# Altium schematic sheet project_pankov_1_power_supply.SchDoc: =title_line_1 + title_line_2
size 594 x 420 mm; SheetNumber: 1
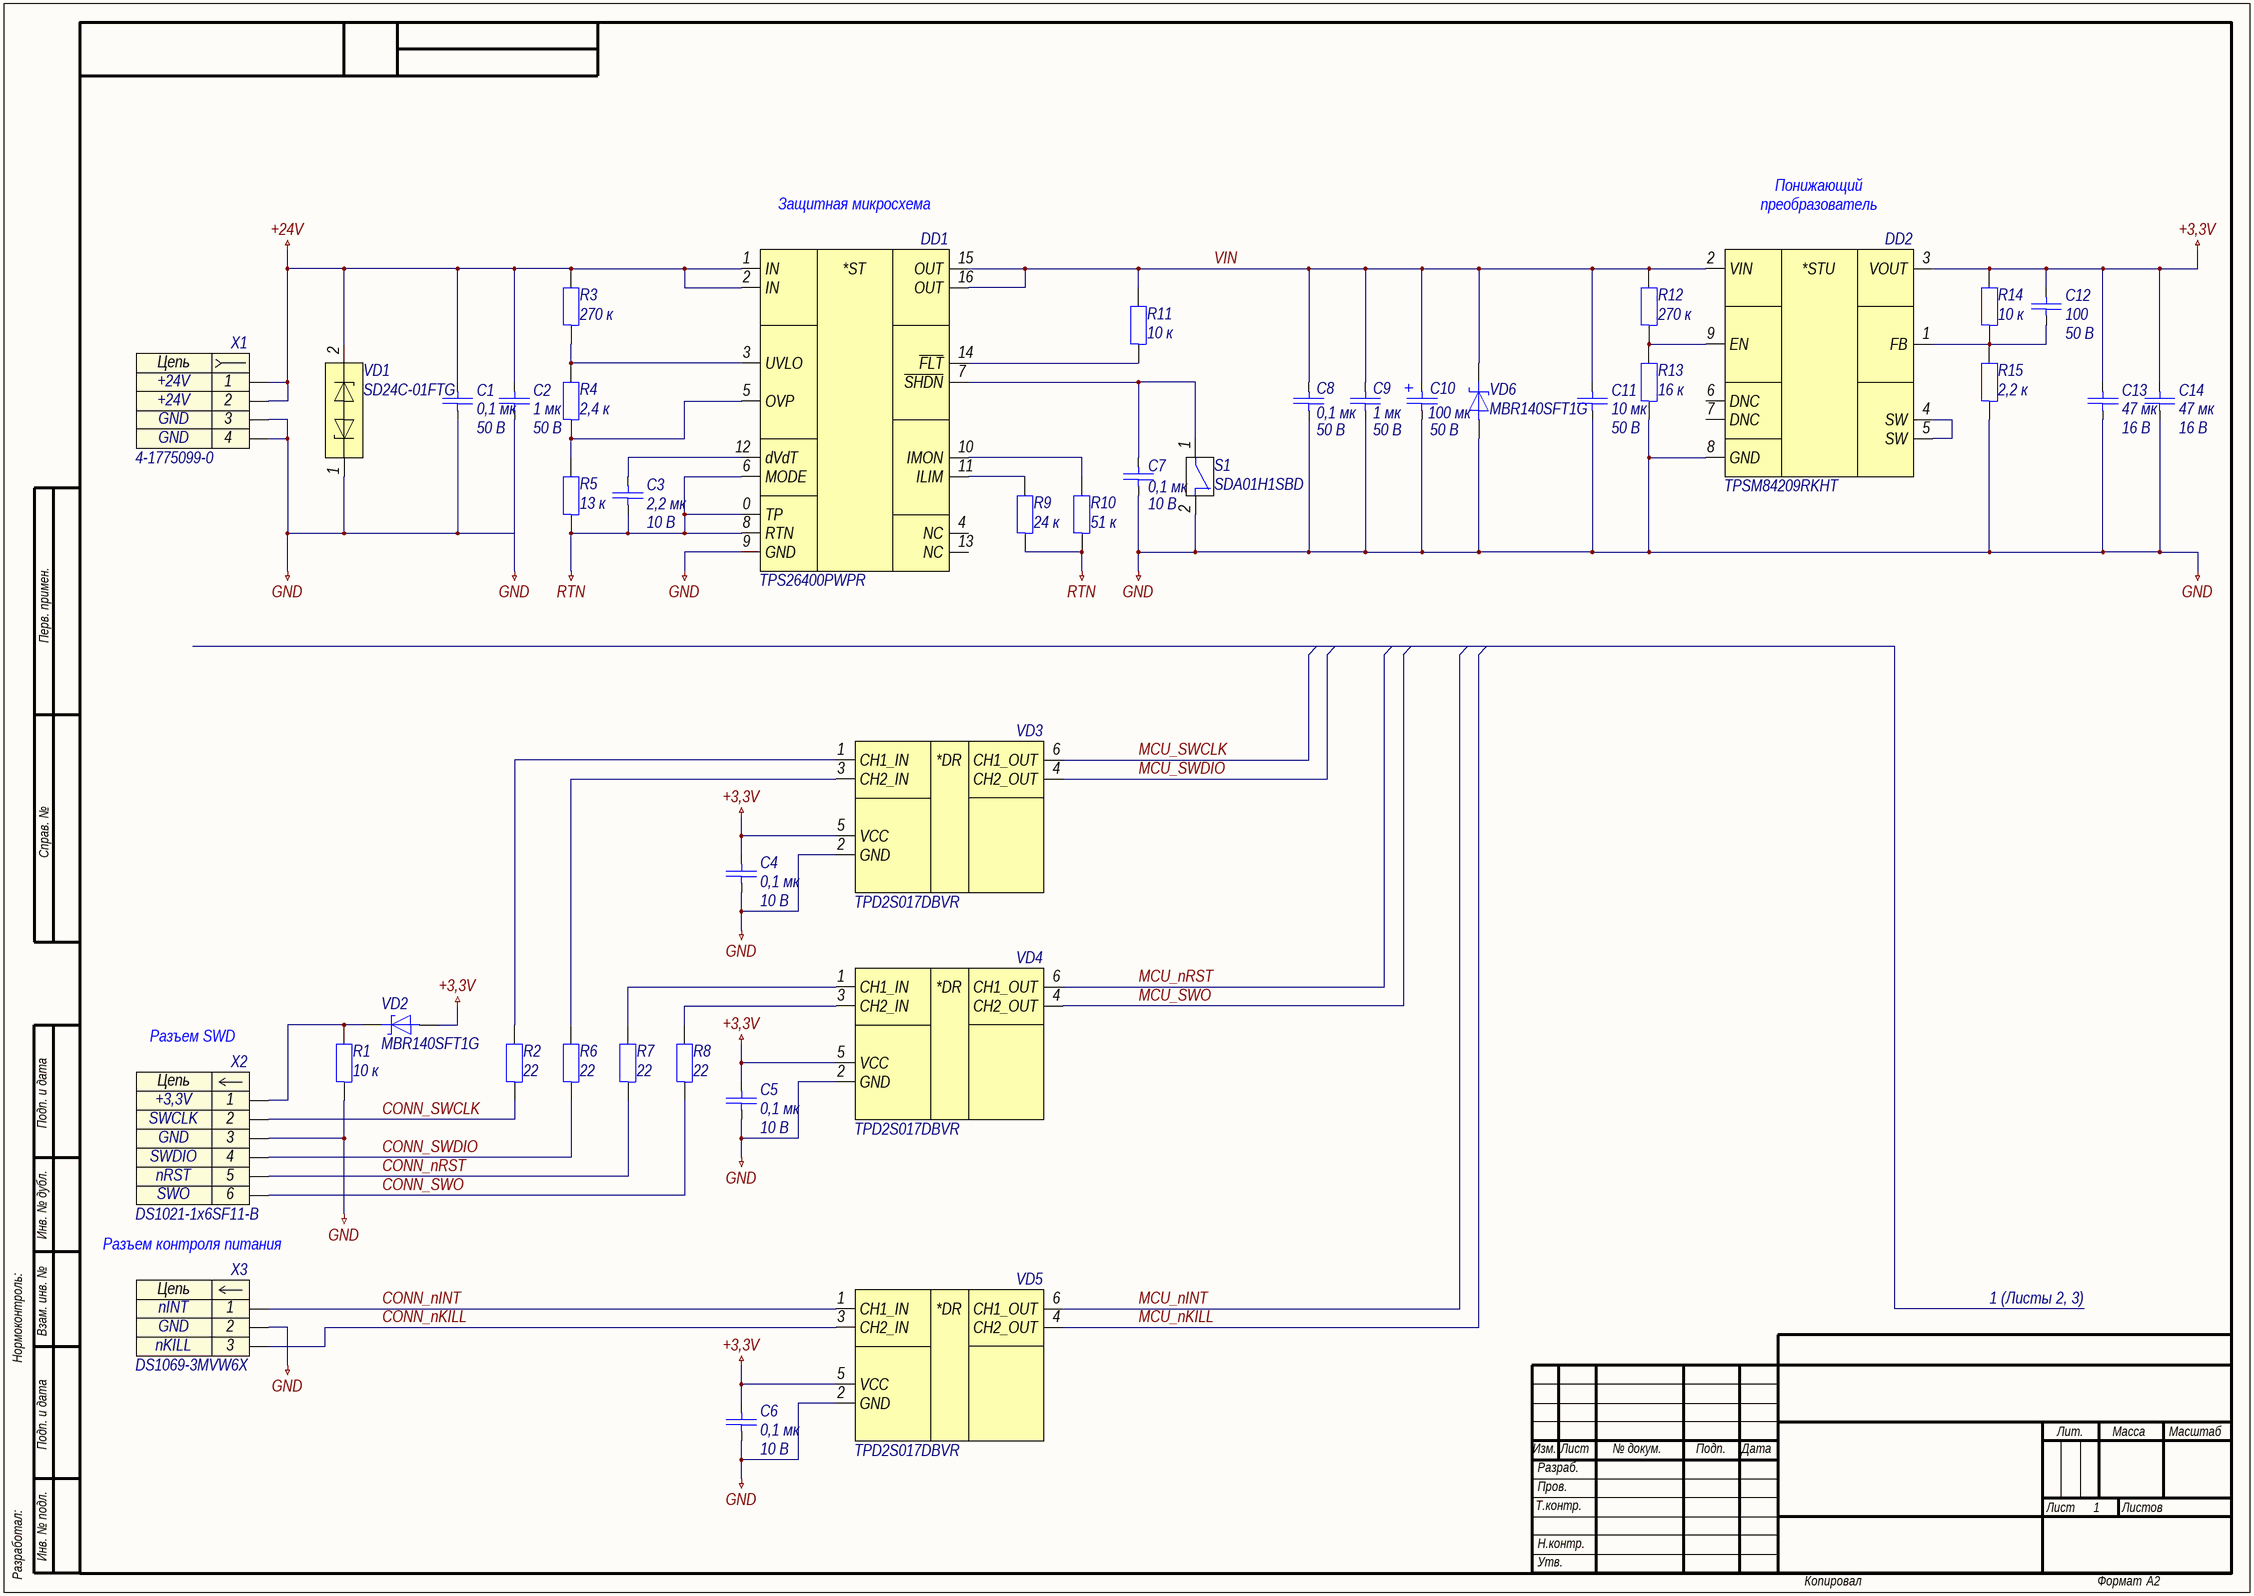
[diagram p0: project_pankov_1_power_supply.SchDoc]

## Parts
C1  0,1 мк  Напряжение: 50 В  [C0603]
C2  1 мк  Напряжение: 50 В  [C0603]
C3  2,2 мк  Напряжение: 10 В  [C0603]
C4  0,1 мк  Напряжение: 10 В  [C0603]
C5  0,1 мк  Напряжение: 10 В  [C0603]
C6  0,1 мк  Напряжение: 10 В  [C0603]
C7  0,1 мк  Напряжение: 10 В  [C0603]
C8  0,1 мк  Напряжение: 50 В  [C0603]
C9  1 мк  Напряжение: 50 В  [C0603]
C10  100 мк  Напряжение: 50 В  [CAPAE-660X660X800]
C11  10 мк  Напряжение: 50 В  [C1206]
C12  100  Напряжение: 50 В  [C0603]
C13  47 мк  Напряжение: 16 В  [C1206]
C14  47 мк  Напряжение: 16 В  [C1206]
DD1  TPS26400PWPR  [HTSSOP-16-P65-500X440X120-L63X25-T246X266]
DD2  TPSM84209RKHT  [QFN-FCMOD-9-P65-450X400X210]
R1  10 к  [R0603]
R2  22  [R0603]
R3  270 к  [R0603]
R4  2,4 к  [R0603]
R5  13 к  [R0603]
R6  22  [R0603]
R7  22  [R0603]
R8  22  [R0603]
R9  24 к  [R0603]
R10  51 к  [R0603]
R11  10 к  [R0603]
R12  270 к  [R0603]
R13  16 к  [R0603]
R14  10 к  [R0603]
R15  2,2 к  [R0603]
S1  SDA01H1SBD  [SDA01H1SBD]
VD1  SD24C-01FTG  [SOD-323-257X130X114]
VD2  MBR140SFT1G  [SOD-123FL-370X165X98]
VD3  TPD2S017DBVR  [SOT-23-6-P95-290X280X145]
VD4  TPD2S017DBVR  [SOT-23-6-P95-290X280X145]
VD5  TPD2S017DBVR  [SOT-23-6-P95-290X280X145]
VD6  MBR140SFT1G  [SOD-123FL-370X165X98]
X1  4-1775099-0  [4-1775099-0]
X2  DS1021-1x6SF11-B  [DS1021-1X6SF11-B]
X3  DS1069-3MVW6X  [DS1069-3MVW6X]

## Nets
+3,3V: C4.1 C5.1 C6.1 C12.1 C13.1 C14.1 DD2.3(VOUT) R14.2 VD2.2 VD3.5(VCC) VD4.5(VCC) VD5.5(VCC)
+24V: C1.1 C2.1 DD1.1(IN) DD1.2(IN) R3.2 VD1.2 X1.1 X1.2
GND: C1.2 C2.2 C4.2 C5.2 C6.2 C7.2 C8.2 C9.2 C10.2 C11.2 C13.2 C14.2 DD1.9(GND) DD2.8(GND) R1.1 R13.1 R15.1 S1.2 VD1.1 VD3.2(GND) VD4.2(GND) VD5.2(GND) VD6.2 X1.3 X1.4 X2.3 X3.2
RTN: C3.2 DD1.0(TP) DD1.6(MODE) DD1.8(RTN) R5.1 R9.1 R10.1
CONN_nINT: VD5.1(CH1_IN) X3.1
CONN_nKILL: VD5.3(CH2_IN) X3.3
CONN_nRST: R7.1 X2.5
CONN_SWCLK: R2.1 X2.2
CONN_SWDIO: R6.1 X2.4
CONN_SWO: R8.1 X2.6
MCU_nINT: VD5.6(CH1_OUT)
MCU_nKILL: VD5.4(CH2_OUT)
MCU_nRST: VD4.6(CH1_OUT)
MCU_SWCLK: VD3.6(CH1_OUT)
MCU_SWDIO: VD3.4(CH2_OUT)
MCU_SWO: VD4.4(CH2_OUT)
VIN: C8.1 C9.1 C10.1 C11.1 DD1.15(OUT) DD1.16(OUT) DD2.2(VIN) R11.2 R12.2 VD6.1
NetC3_1: C3.1 DD1.12(dVdT)
NetC7_1: C7.1 DD1.7(~{SHDN}) S1.1
NetC12_2: C12.2 DD2.1(FB) R14.1 R15.2
NetDD1_3: DD1.3(UVLO) R3.1 R4.2
NetDD1_5: DD1.5(OVP) R4.1 R5.2
NetDD1_10: DD1.10(IMON) R10.2
NetDD1_11: DD1.11(ILIM) R9.2
NetDD1_14: DD1.14(~{FLT}) R11.1
NetDD2_4: DD2.4(SW) DD2.5(SW)
NetDD2_9: DD2.9(EN) R12.1 R13.2
NetR1_2: R1.2 VD2.1 X2.1
NetR2_2: R2.2 VD3.1(CH1_IN)
NetR6_2: R6.2 VD3.3(CH2_IN)
NetR7_2: R7.2 VD4.1(CH1_IN)
NetR8_2: R8.2 VD4.3(CH2_IN)

Not connected (* = marked no-connect by the designer): DD1 4(NC) 13(NC); DD2 6(DNC) 7(DNC)

## Notes on the sheet
- Понижающий преобразователь напряжения 12 В/3,3 В
- (near DD1) Защитная микросхема
- Разъем SWD
- Разъем контроля питания
- 1 (Листы 2, 3)
- Перв. примен.
- Справ. №
- Подп. и дата
- Инв. № дубл.
- Нормоконтроль:
- Взам. инв. №
- Изм.
- Лист
- № докум.
- Подп.
- Дата
- Лит.
- Масса
- Масштаб
- Т.контр.
- Пров.
- Разраб.
- Листов
- Разработал:
- Инв. № подл.
- Н.контр.
- Утв.
- Копировал
- Формат
- А2
- (in symbol dd0005) *ST
- (in symbol dd0020) *STU
- (in symbol vd0016) *DR
- (in symbol x0006) Цепь
- (in symbol x0028) Цепь
- (in symbol x0043) Цепь

## Library data of the parts
C1 C8 = c0065: =Описание; ID: c0065; Фамилия: Паньков; Описание: Конденсатор керамический чип 0603 100 нФ 50 В ±10 %; Наименование: CC0603KRX7R9BB104; Производитель: YAGEO Corp.; Отклонение: ±10 %; Рабочие температуры: от –55 °С до +125 °С; Температурный коэффициент емкости: X7R; Корпус: 0603; Номинал: 0,1 мк; Номинальное напряжение: 50 В; HelpURL: https://www.yageo.com/upload/media/product/productsearch/datasheet/mlcc/UPY-GPHC_X7R_6.3V-to-50V_20.pdf
C2 C9 = c0095: =Описание; ID: c0095; Фамилия: Паньков; Описание: Конденсатор керамический чип 0603 1 мкФ 50 В ±10 %; Наименование: CC0603KRX7R9BB105; Производитель: YAGEO Corp.; Отклонение: ±10 %; Рабочие температуры: от –55 °С до +125 °С; Температурный коэффициент емкости: X7R; Корпус: 0603; Номинал: 1 мк; Номинальное напряжение: 50 В; HelpURL: https://www.yageo.com/upload/media/product/productsearch/datasheet/mlcc/UPY-GPHC_X7R_6.3V-to-50V_20.pdf
C3 = c0100: =Описание; ID: c0100; Фамилия: Чернов; Описание: Конденсатор керамический чип 0603 2,2 мкФ 10 В ±10 %; Наименование: CC0603KRX7R6BB225; Производитель: YAGEO Corp.; Отклонение: ±10 %; Рабочие температуры: от –55 °С до +125 °С; Температурный коэффициент емкости: X7R; Корпус: 0603; Номинал: 2,2 мк; Номинальное напряжение: 10 В; HelpURL: https://www.yageo.com/upload/media/product/productsearch/datasheet/mlcc/UPY-GPHC_X7R_6.3V-to-50V_20.pdf
C4-C6 = c0077: =Описание; ID: c0077; Фамилия: Паньков; Описание: Конденсатор керамический чип 0603 100 нФ 10 В ±10 %; Наименование: CC0603KRX7R6BB104; Производитель: YAGEO Corp.; Отклонение: ±10 %; Рабочие температуры: от –55 °С до +125 °С; Температурный коэффициент емкости: X7R; Корпус: 0603; Номинал: 0,1 мк; Номинальное напряжение: 10 В; HelpURL: https://www.yageo.com/upload/media/product/productsearch/datasheet/mlcc/UPY-GPHC_X7R_6.3V-to-50V_20.pdf
C7 = c0057: =Описание; ID: c0057; Фамилия: Паньков; Описание: Конденсатор керамический чип 0603 100 нФ 10 В ±10 %; Наименование: CC0603KRX7R6BB104; Производитель: YAGEO Corp.; Отклонение: ±10 %; Рабочие температуры: от –55 °С до +125 °С; Температурный коэффициент емкости: X7R; Корпус: 0603; Номинал: 0,1 мк; Номинальное напряжение: 10 В; HelpURL: https://www.yageo.com/upload/media/product/productsearch/datasheet/mlcc/UPY-GPHC_X7R_6.3V-to-50V_20.pdf
C10 = c0168: =Описание; ID: c0168; Фамилия: Паньков; Описание: Конденсатор электролитический алюминиевый 100 мкФ 50 В ±20 %; Наименование: EEEFTH101XAP; Производитель: Panasonic Corporation; Отклонение: ±20 %; Эквивалентное последовательное сопротивление: 0,34 Ом; Среднеквадратичный размах пульсации тока: 0,35 А; Рабочие температуры: от –55 °С до +105 °С; Корпус: CAPAE (6,6 x 6,6 x 8,0); Номинал: 100 мк; Номинальное напряжение: 50 В; HelpURL: https://industrial.panasonic.com/ww/products/capacitors/aluminum-capacitors/aluminum-cap-smd/models/EEEFTH101XAP
C11 = c0148: =Описание; ID: c0148; Фамилия: Самарин; Описание: Конденсатор керамический чип 1206 10 мкФ 50 В ±10 %; Наименование: CC1206KKX5R9BB106; Производитель: YAGEO Corp.; Отклонение: ±10 %; Рабочие температуры: от –55 °С до +85 °С; Температурный коэффициент емкости: X5R; Корпус: 1206; Номинал: 10 мк; Номинальное напряжение: 50 В; HelpURL: https://www.yageo.com/upload/media/product/productsearch/datasheet/mlcc/UPY-GPHC_X5R_4V-to-50V_26.pdf
C12 = c0023: =Описание; ID: c0023; Фамилия: Паньков; Описание: Конденсатор керамический чип 0603 100 пФ 50 В ±1 %; Наименование: CC0603FRNPO9BN101; Производитель: YAGEO Corp.; Отклонение: ±1 %; Рабочие температуры: от –55 °С до +125 °С; Температурный коэффициент емкости: C0G; Корпус: 0603; Номинал: 100; Номинальное напряжение: 50 В; HelpURL: https://www.yageo.com/upload/media/product/productsearch/datasheet/mlcc/UPY-GP_NP0_16V-to-50V_18.pdf
C13 C14 = c0166: =Описание; ID: c0166; Фамилия: Паньков; Описание: Конденсатор керамический чип 1206 47 мкФ 16 В ±20 %; Наименование: CC1206MKX5R7BB476; Производитель: YAGEO Corp.; Отклонение: ±20 %; Рабочие температуры: от –55 °С до +85 °С; Температурный коэффициент емкости: X5R; Корпус: 1206; Номинал: 47 мк; Номинальное напряжение: 16 В; HelpURL: https://www.yageo.com/upload/media/product/productsearch/datasheet/mlcc/UPY-GPHC_X5R_4V-to-50V_26.pdf
DD1 = dd0005: =Описание; ID: dd0005; Фамилия: Паньков; Описание: Защитная микросхема eFuse 42 В и 2 А; Производитель: Texas Instruments Inc.; Напряжение: от 4,2 В до 42 В; Максимальное напряжение: 55 В; Ток: от 0,1 А до 2,23 А; Рабочие температуры: от –40 °С до +125 °С; Корпус: HTSSOP-16; Наименование: TPS26400PWPR; HelpURL: https://www.ti.com/product/TPS2640
DD2 = dd0020: =Описание; ID: dd0020; Фамилия: Паньков; Описание: Понижающий преобразователь напряжения 28 В и 2,5 А; Производитель: Texas Instruments Inc.; Входное напряжение: от 4,5 В до 28 В; Выходное напряжение: от 1,2 В до 6 В; Коммутируемый ток: до 2,5 А; Частота переключения: от 578 кГц до 923 кГц; Рабочие температуры: от –40 °С до +85 °С; Корпус: QFN-FCMOD-9; Наименование: TPSM84209RKHT; HelpURL: https://www.ti.com/product/TPSM84209
R1 R11 R14 = r0105: =Описание; ID: r0105; Фамилия: Самарин; Описание: Резистор чип 0603 10 кОм ±1 % 0,1 Вт; Наименование: RC0603FR-0710KL; Производитель: YAGEO Corp.; Отклонение: ±1 %; Номинальное напряжение: 75 В; Номинальный ток: 1 А; Рабочие температуры: от –55 °С до +155 °С; Корпус: 0603; Примечание: Ряд E24; Номинал: 10 к; HelpURL: https://www.yageo.com/upload/media/product/productsearch/datasheet/rchip/PYu-RC_Group_51_RoHS_L_11.pdf
R2 R6-R8 = r0034: =Описание; ID: r0034; Фамилия: Ларионов; Описание: Резистор чип 0603 22 Ом ±1 % 0,1 Вт; Наименование: RC0603FR-0722RL; Производитель: YAGEO Corp.; Отклонение: ±1 %; Номинальное напряжение: 75 В; Номинальный ток: 1 А; Рабочие температуры: от –55 °С до +155 °С; Корпус: 0603; Примечание: Ряд E24; Номинал: 22; HelpURL: https://www.yageo.com/upload/media/product/productsearch/datasheet/rchip/PYu-RC_Group_51_RoHS_L_11.pdf
R3 R12 = r0157: =Описание; ID: r0157; Фамилия: Паньков; Описание: Резистор чип 0603 270 кОм ±1 % 0,1 Вт; Наименование: RC0603FR-07270KL; Производитель: YAGEO Corp.; Отклонение: ±1 %; Номинальное напряжение: 75 В; Номинальный ток: 1 А; Рабочие температуры: от –55 °С до +155 °С; Корпус: 0603; Примечание: Ряд E24; Номинал: 270 к; HelpURL: https://www.yageo.com/upload/media/product/productsearch/datasheet/rchip/PYu-RC_Group_51_RoHS_L_11.pdf
R4 = r0086: =Описание; ID: r0086; Фамилия: Паньков; Описание: Резистор чип 0603 2,4 кОм ±1 % 0,1 Вт; Наименование: RC0603FR-072K4L; Производитель: YAGEO Corp.; Отклонение: ±1 %; Номинальное напряжение: 75 В; Номинальный ток: 1 А; Рабочие температуры: от –55 °С до +155 °С; Корпус: 0603; Примечание: Ряд E24; Номинал: 2,4 к; HelpURL: https://www.yageo.com/upload/media/product/productsearch/datasheet/rchip/PYu-RC_Group_51_RoHS_L_11.pdf
R5 = r0110: =Описание; ID: r0110; Фамилия: Жернаков; Описание: Резистор чип 0603 13 кОм ±1 % 0,1 Вт; Наименование: RC0603FR-0713KL; Производитель: YAGEO Corp.; Отклонение: ±1 %; Номинальное напряжение: 75 В; Номинальный ток: 1 А; Рабочие температуры: от –55 °С до +155 °С; Корпус: 0603; Примечание: Ряд E24; Номинал: 13 к; HelpURL: https://www.yageo.com/upload/media/product/productsearch/datasheet/rchip/PYu-RC_Group_51_RoHS_L_11.pdf
R9 = r0118: =Описание; ID: r0118; Фамилия: Паньков; Описание: Резистор чип 0603 24 кОм ±1 % 0,1 Вт; Наименование: RC0603FR-0724KL; Производитель: YAGEO Corp.; Отклонение: ±1 %; Номинальное напряжение: 75 В; Номинальный ток: 1 А; Рабочие температуры: от –55 °С до +155 °С; Корпус: 0603; Примечание: Ряд E24; Номинал: 24 к; HelpURL: https://www.yageo.com/upload/media/product/productsearch/datasheet/rchip/PYu-RC_Group_51_RoHS_L_11.pdf
R10 = r0131: =Описание; ID: r0131; Фамилия: Паньков; Описание: Резистор чип 0603 51 кОм ±1 % 0,1 Вт; Наименование: RC0603FR-0751KL; Производитель: YAGEO Corp.; Отклонение: ±1 %; Номинальное напряжение: 75 В; Номинальный ток: 1 А; Рабочие температуры: от –55 °С до +155 °С; Корпус: 0603; Примечание: Ряд E24; Номинал: 51 к; HelpURL: https://www.yageo.com/upload/media/product/productsearch/datasheet/rchip/PYu-RC_Group_51_RoHS_L_11.pdf
R13 = r0112: =Описание; ID: r0112; Фамилия: Паньков; Описание: Резистор чип 0603 16 кОм ±1 % 0,1 Вт; Наименование: RC0603FR-0716KL; Производитель: YAGEO Corp.; Отклонение: ±1 %; Номинальное напряжение: 75 В; Номинальный ток: 1 А; Рабочие температуры: от –55 °С до +155 °С; Корпус: 0603; Примечание: Ряд E24; Номинал: 16 к; HelpURL: https://www.yageo.com/upload/media/product/productsearch/datasheet/rchip/PYu-RC_Group_51_RoHS_L_11.pdf
R15 = r0085: =Описание; ID: r0085; Фамилия: Паньков; Описание: Резистор чип 0603 2,2 кОм ±1 % 0,1 Вт; Наименование: RC0603FR-072K2L; Производитель: YAGEO Corp.; Отклонение: ±1 %; Номинальное напряжение: 75 В; Номинальный ток: 1 А; Рабочие температуры: от –55 °С до +155 °С; Корпус: 0603; Примечание: Ряд E24; Номинал: 2,2 к; HelpURL: https://www.yageo.com/upload/media/product/productsearch/datasheet/rchip/PYu-RC_Group_51_RoHS_L_11.pdf
S1 = s0005: =Описание; ID: s0005; Фамилия: Паньков; Описание: 2-х позиционный движковый переключатель; Производитель: C&K; Ток нагрузки: 100 мА @ 5 В; Сопротивление контакта: 50 мОм; Количество контактов: 2; Рабочие температуры: от –40 °С до +85 °С; Промывка: Запрещена; Корпус: 4,52 х 9,30 х 5,45; Наименование: SDA01H1SBD; HelpURL: https://www.ckswitches.com/products/switches/product-details/DIP/SDA/SDA01H1SBD/
VD1 = vd0007: =Описание; ID: vd0007; Фамилия: Игнатова; Описание: Двунаправленная диодная сборка для подавления помех 24 В; Производитель: Littelfuse, Inc.; Корпус: SOD-323; Наименование: SD24C-01FTG; HelpURL: https://www.littelfuse.com/products/tvs-diode-arrays/general-purpose-esd-protection/sdc/sd24c_01ftg.aspx
VD2 VD6 = vd0002: =Описание; ID: vd0002; Фамилия: Паньков; Описание: Диод Шоттки 40 В 1 А; Производитель: ON Semiconductor; Максимальное прямое напряжение: 0,88 В; Максимальное обратное напряжение: 40 В; Максимальный прямой ток: 1 А; Рабочие температуры: от –55 °С до +125 °С; Корпус: SOD-123FL; Наименование: MBR140SFT1G; HelpURL: https://www.onsemi.com/products/discretes-drivers/diodes-rectifiers/schottky-diodes-schottky-rectifiers/mbr140sf
VD3-VD5 = vd0016: =Описание; ID: vd0016; Фамилия: Паньков; Описание: Диодная сборка для подавления помех 5 В; Производитель: Texas Instruments Inc.; Корпус: SOT-23-6; Наименование: TPD2S017DBVR; HelpURL: https://www.ti.com/product/TPD2S017
X1 = x0006: =Описание; Contact_1: +24V; Contact_3: GND; ID: x0006; Фамилия: Ларионов; Описание: ATX Power 4 pin гнездо прямой; Производитель: TE Connectivity; Contact_2: +24V; Contact_4: GND; Наименование: 4-1775099-0; HelpURL: https://www.te.com/usa-en/product-4-1775099-0.html
X2 = x0028: =Описание; Contact_1: +3,3V; Contact_2: SWCLK; Contact_3: GND; Contact_4: SWDIO; Contact_5: nRST; Contact_6: SWO; ID: x0028; Фамилия: Паньков; Описание: PLS 6 pin 2,54 мм вилка прямой; Производитель: Connfly Electronic Co., Ltd.; Наименование: DS1021-1x6SF11-B; HelpURL: http://en.connfly.group/product/xVkr=EusQssAN0gN=Aos=mU+UrVkR9kqEAN0gN9g+WqANB+A
X3 = x0043: =Описание; Contact_1: nINT; Contact_2: GND; Contact_3: nKILL; ID: x0043; Фамилия: Паньков; Описание: CWF 3 pin 2,5 мм вилка прямой; Производитель: Connfly Electronic Co., Ltd.; Наименование: DS1069-3MVW6X; HelpURL: http://en.connfly.group/product/xVkr=EusQssAN0gN=Aos=mU+UrVkR9kqEAN0gN0MUR+g+NB+A